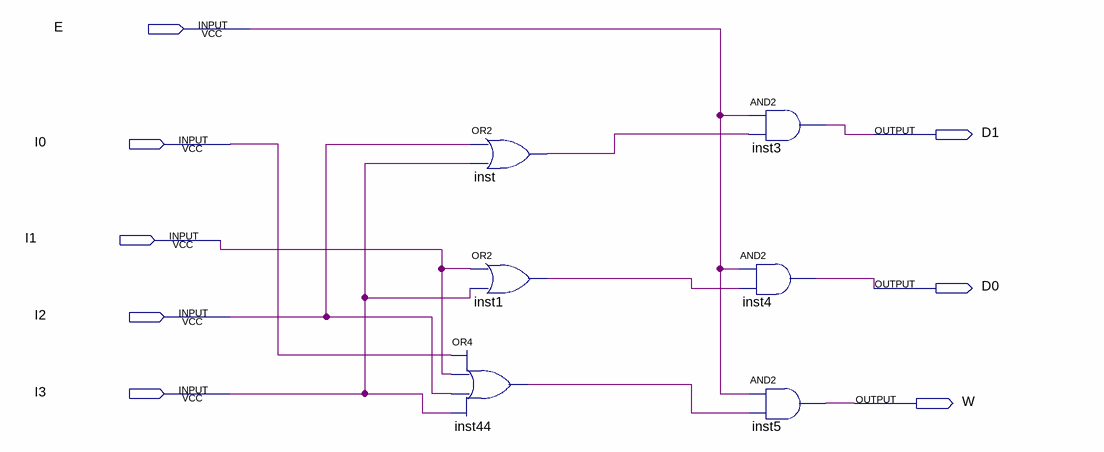
[diagram p0: schematic sheet]
// Quartus schematic cd4-2.bdf as structural Verilog: 6 symbols, 8 pins
module \cd4-2  (
  input  E,
  input  I0,
  input  I1,
  input  I2,
  input  I3,
  output D1,
  output D0,
  output W
);

  wire inst1_out, inst44_out, inst_out;

  or inst (inst_out, I2, I3);
  or inst1 (inst1_out, I1, I3);
  or inst44 (inst44_out, I0, I1, I2, I3);
  and inst3 (D1, E, inst_out);
  and inst4 (D0, E, inst1_out);
  and inst5 (W, E, inst44_out);
endmodule
